# Altium schematic sheet MultimetrosETC.SchDoc
size A4
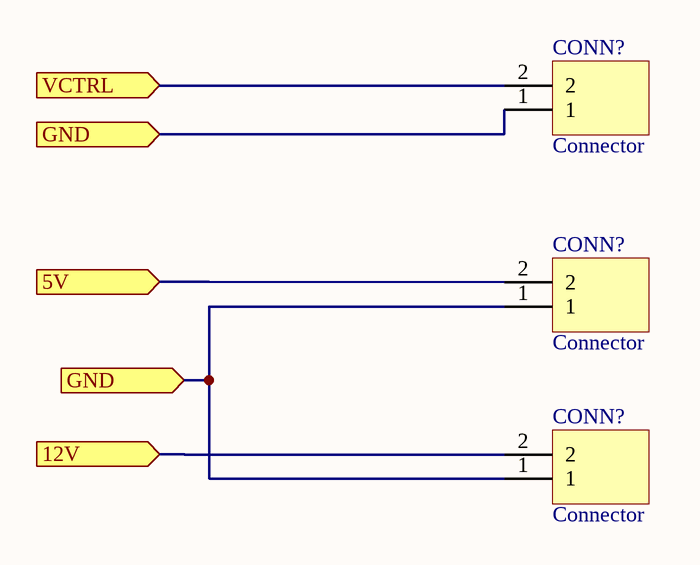
[diagram p0: MultimetrosETC.SchDoc]

## Parts
(Parts that share a designator on the sheet are numbered #1, #2 ... from top to bottom, then left to right.)
CONN?#1  Connector  [1x2x2.54 Pin Header TH V]
CONN?#2  Connector  [1x2x2.54 Pin Header TH V]
CONN?#3  Connector  [1x2x2.54 Pin Header TH V]

## Ports
5V (in), 12V (in), GND (in), VCTRL (in)

## Nets
5V: CONN?#2.2 ; port 5V
12V: CONN?#3.2 ; port 12V
GND: CONN?#1.1 CONN?#2.1 CONN?#3.1 ; port GND
VCTRL: CONN?#1.2 ; port VCTRL

## Library data of the parts
CONN?#1-CONN?#3 = Header 1x2